# EAGLE design br-actuonix (EAGLE 9.2.2)
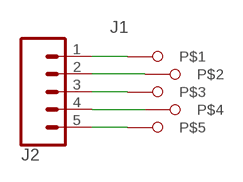
[diagram p0: schematic, sheet 1]

## Parts
J1  5PIN  [5PIN]
J2  CONN_05PTH_LONGPADS  [1X05_LONGPADS]

## Nets
N$1: J1.1 J2.1
N$2: J1.2 J2.2
N$3: J1.3 J2.3
N$4: J1.4 J2.4
N$5: J1.5 J2.5

## Library data of the parts
J1 = 0SoK:5PIN
J2 = SparkFun-Connectors:CONN_05: Multi connection point. Often used as Generic Header-pin footprint for 0.1 inch spaced/style header connections On any of the 0.1 inch spaced packages, you can populate with these: Break Away Headers - Straight <https://www.sparkfun.com/products/116> (PRT-00116) Break Away Male Headers - Right Angle <https://www.sparkfun.com/products/553> (PRT-00553) Female Headers <https://www.sparkfun.com/products/115> (PRT-00115) Break Away Headers - Machine Pin <https://www.sparkfun.com/products/117> (PRT-00117) Break Away Female Headers - Swiss Machine Pin <https://www.sparkfun.com/products/743> (PRT-00743) For SCREWTERMINALS and SPRING TERMINALS visit here: Screw Terimnals on SparkFun.com <https://www.sparkfun.com/search/results?term=Screw+Terminals> (5mm/3.5mm/2.54mm spacing) This device is also useful as a general connection point to wire up your design to another part of your project. Our various solder wires solder well into these plated through hole pads. Hook-Up Wire - Assortment (Stranded, 22 AWG) <https://www.sparkfun.com/products/11375> (PRT-11375) Hook-Up Wire - Assortment (Solid Core, 22 AWG) <https://www.sparkfun.com/products/11367> (PRT-11367) View the entire wire category on our website here <https://www.sparkfun.com/categories/141> Special notes: Molex polarized connector foot print use with SKU : PRT-08231 with associated crimp pins and housings. 1MM SMD Version SKU: PRT-10208

## Board
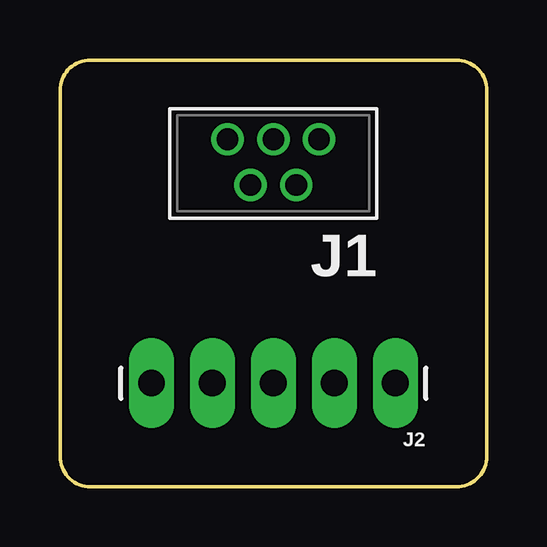
[diagram p1: board, top side]
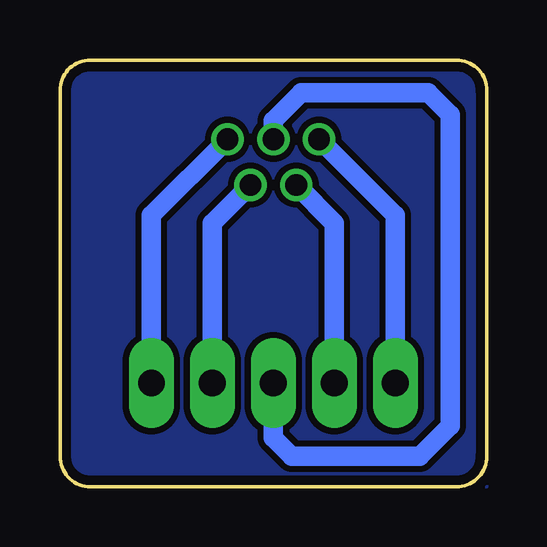
[diagram p2: board, bottom side, seen from below]

Size 17.78 x 17.78 mm. Coordinates in mm from the lower left corner, seen from the top.
Outline: 1.27,0 16.51,0 arc90 17.78,1.27 17.78,16.51 arc90 16.51,17.78 1.27,17.78 arc90 0,16.51 0,1.27 arc90 1.27,0
Copper layers (1*16): Top 0.035559375mm / dielectric 1.6mm / Bottom 0.035559375mm
Design rules "oshpark-2layer": minimum track width 6mil, minimum drill 10mil, track to track 6mil, track to pad 6mil, pad to pad 6mil, via to via 6mil, smd to smd 6mil, copper to edge 15mil, drill to drill 6mil, minimum pad ring 5mil, minimum via ring 5mil, stop-mask expansion 2.5mil, vias tented up to drill 0mil, thermal gap 10mil

### Footprints (pad centres in the part's own frame; a part is rotated, then mirrored left to right if it is on the bottom)
5PIN = drill 0.9: 1 -1.905,0; 2 -0.953,1.905; 3 0,0; 4 0.953,1.905; 5 1.905,0
1X05_LONGPADS = drill 1.118 pad 1.88 long: 1 0,0; 2 2.54,0; 3 5.08,0; 4 7.62,0; 5 10.16,0

### Placement (x,y rotation side)
J1  8.89,14.48 180 top
J2  13.97,4.32 180 top

### Tracks (layer width: path | path; a pad name or v marks a point on that pad's centre or on a via)
GND
  pour Bottom (isolate 0.254): 0,17.78 0,0 17.78,0 17.78,17.78
N$1
  Bottom 0.813: J1.1 13.97,11.3 J2.1
N$2
  Bottom 0.813: J1.2 11.43,10.98 J2.2
N$3
  Bottom 0.813: J2.3 8.89,2.03 8.13,1.27 2.79,1.27 1.52,2.54 1.52,15.49 2.44,16.41 7.72,16.41 8.89,15.24 J1.3
N$4
  Bottom 0.813: J1.4 6.35,10.98 J2.4
N$5
  Bottom 0.813: J1.5 3.81,11.3 J2.5